# EAGLE design ESP32Weatherstation (EAGLE 9.5.2)
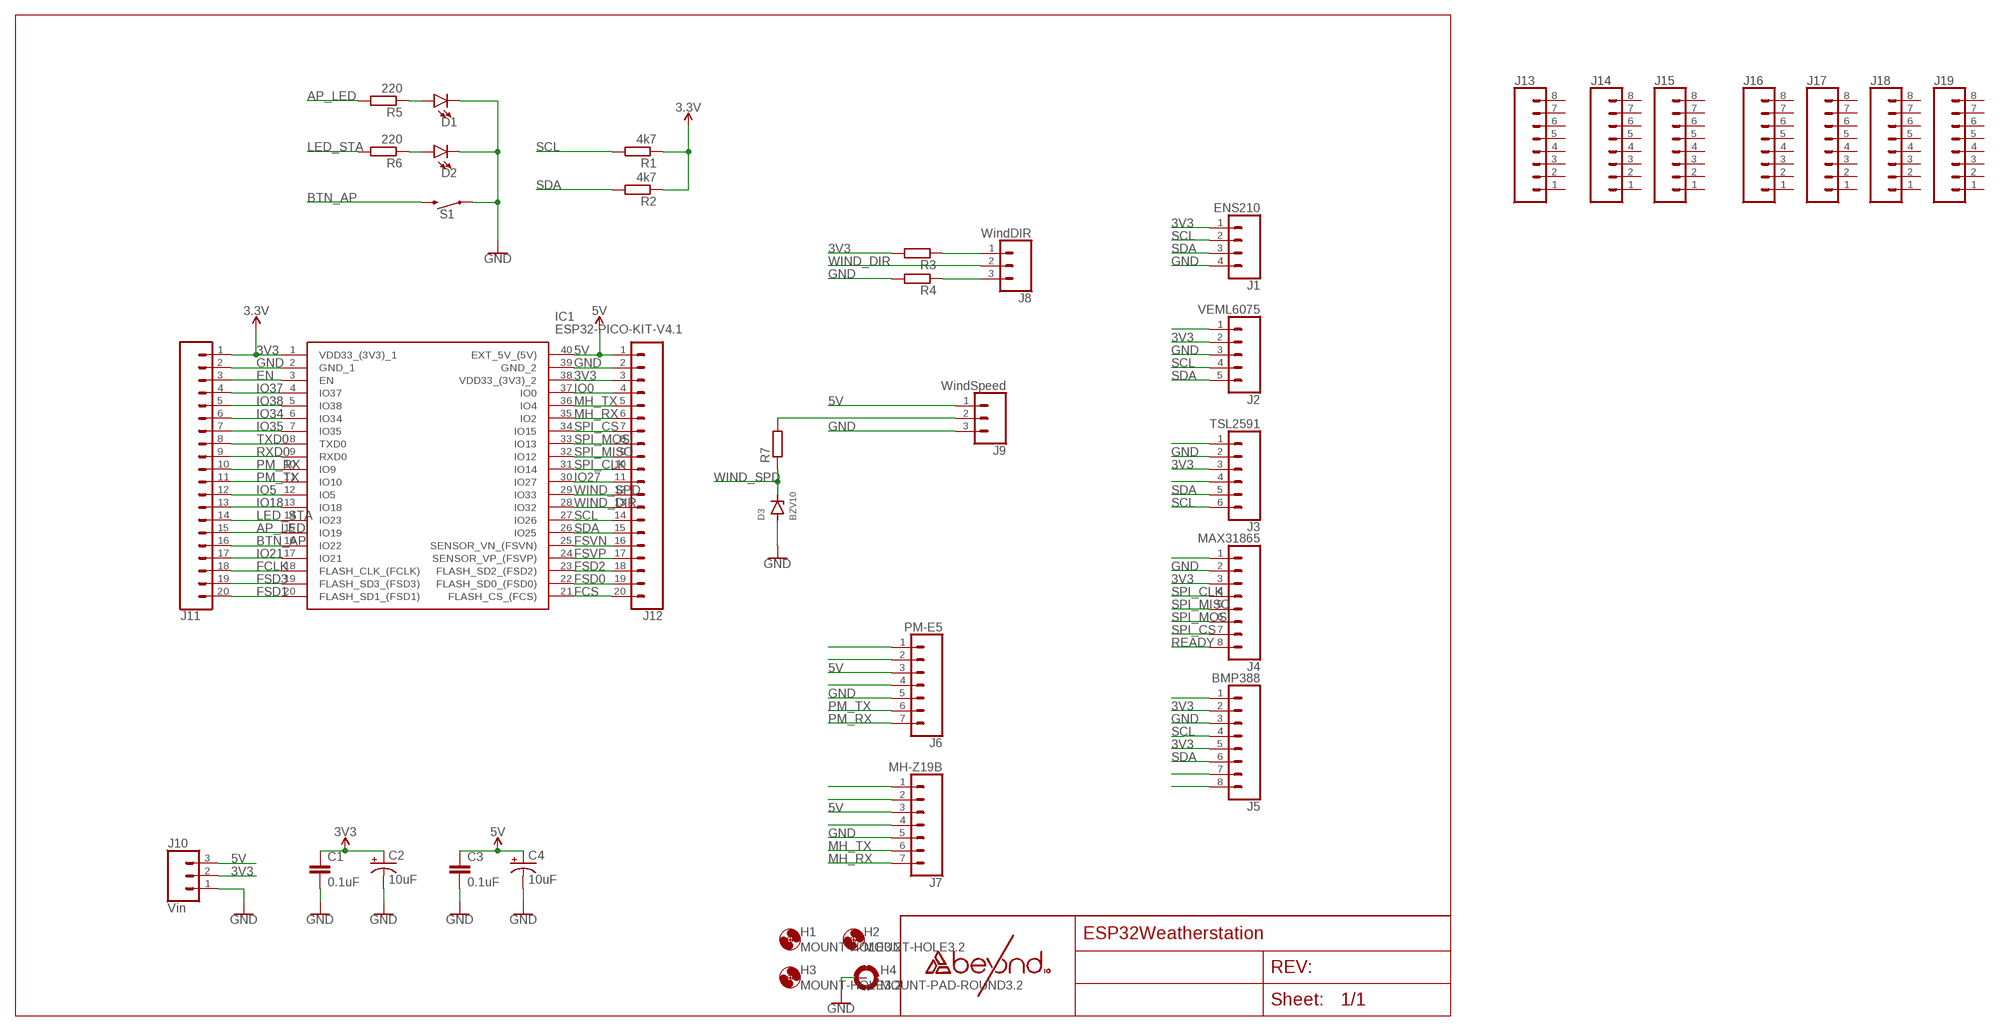
[diagram p0: schematic, sheet 1]

## Parts
C1  0.1uF  0.1UF-0603-25V-5%  [0603]
C2  10uF  10UF-POLAR-EIA3216-16V-10%(TANT)  [EIA3216]
C3  0.1uF  0.1UF-0603-25V-5%  [0603]
C4  10uF  10UF-POLAR-EIA3216-16V-10%(TANT)  [EIA3216]
D1  LED3MM  [LED_3MM]
D2  LED3MM  [LED_3MM]
D3  BZV10  [DO34Z7]
H1  MOUNT-HOLE3.2  [3,2]
H2  MOUNT-HOLE3.2  [3,2]
H3  MOUNT-HOLE3.2  [3,2]
H4  MOUNT-PAD-ROUND3.2  [3,2-PAD]
IC1  ESP32-PICO-KIT-V4.1  [DIPS1778W60P254L5200H1300Q40N]
J1  ENS210  CONN_041X04_NO_SILK  [1X04_NO_SILK]
J2  VEML6075  CONN_05NO_SILK  [1X05_NO_SILK]
J3  TSL2591  CONN_06NO_SILK_FEMALE_PTH  [1X06_NO_SILK]
J4  MAX31865  CONN_08NO_SILK_FEMALE_PTH  [1X08_NO_SILK]
J5  BMP388  CONN_08NO_SILK_FEMALE_PTH  [1X08_NO_SILK]
J6  PM-E5  CONN_07NO_SILK  [1X07_NO_SILK]
J7  MH-Z19B  CONN_07NO_SILK  [1X07_NO_SILK]
J8  WindDIR  CONN_031X03_NO_SILK  [1X03_NO_SILK]
J9  WindSpeed  CONN_031X03_NO_SILK  [1X03_NO_SILK]
J10  Vin  CONN_031X03_NO_SILK  [1X03_NO_SILK]
J11  CONN_20NOSILK  [1X20_NOSILK]
J12  CONN_20NOSILK  [1X20_NOSILK]
J13  CONN_08NO_SILK_FEMALE_PTH  [1X08_NO_SILK]
J14  CONN_08NO_SILK_FEMALE_PTH  [1X08_NO_SILK]
J15  CONN_08NO_SILK_FEMALE_PTH  [1X08_NO_SILK]
J16  CONN_08NO_SILK_FEMALE_PTH  [1X08_NO_SILK]
J17  CONN_08NO_SILK_FEMALE_PTH  [1X08_NO_SILK]
J18  CONN_08NO_SILK_FEMALE_PTH  [1X08_NO_SILK]
J19  CONN_08NO_SILK_FEMALE_PTH  [1X08_NO_SILK]
R1  4k7  R-EU_0207/10  [0207/10]
R2  4k7  R-EU_0207/10  [0207/10]
R3  R-EU_0207/10  [0207/10]
R4  R-EU_0207/10  [0207/10]
R5  220  R-EU_0207/10  [0207/10]
R6  220  R-EU_0207/10  [0207/10]
R7  R-EU_0207/10  [0207/10]
S1  MOMENTARY-SWITCH-SPST-SMD-5.2MM  [TACTILE_SWITCH_SMD_5.2MM]

## Nets
3V3: C1.1 C2.+ IC1.1(VDD33_(3V3)_1) IC1.38(VDD33_(3V3)_2) J1.1 J2.2 J3.3 J4.3 J5.2 J5.5 J10.2 J11.1 J12.3 R1.1 R2.1 R3.2 ; supply symbol labelled 3.3V
5V: C3.1 C4.+ IC1.40(EXT_5V_(5V)) J6.3 J7.3 J9.1 J10.3 J12.1
AP_LED: IC1.15(IO19) J11.15 R5.2
BTN_AP: IC1.16(IO22) J11.16 S1.3
EN: IC1.3(EN) J11.3
FCLK: IC1.18(FLASH_CLK_(FCLK)) J11.18
FCS: IC1.21(FLASH_CS_(FCS)) J12.20
FSD0: IC1.22(FLASH_SD0_(FSD0)) J12.19
FSD1: IC1.20(FLASH_SD1_(FSD1)) J11.20
FSD2: IC1.23(FLASH_SD2_(FSD2)) J12.18
FSD3: IC1.19(FLASH_SD3_(FSD3)) J11.19
FSVN: IC1.25(SENSOR_VN_(FSVN)) J12.16
FSVP: IC1.24(SENSOR_VP_(FSVP)) J12.17
GND: C1.2 C2.- C3.2 C4.- D1.K(C) D2.K(C) D3.A H4.B3,2(MOUNT) IC1.2(GND_1) IC1.39(GND_2) J1.4 J2.3 J3.2 J4.2 J5.3 J6.5 J7.5 J9.3 J10.1 J11.2 J12.2 R4.2 S1.1
IO0: IC1.37(IO0) J12.4
IO5: IC1.12(IO5) J11.12
IO18: IC1.13(IO18) J11.13
IO21: IC1.17(IO21) J11.17
IO27: IC1.30(IO27) J12.11
IO34: IC1.6(IO34) J11.6
IO35: IC1.7(IO35) J11.7
IO37: IC1.4(IO37) J11.4
IO38: IC1.5(IO38) J11.5
LED_STA: IC1.14(IO23) J11.14 R6.2
MH_RX: IC1.35(IO2) J7.7 J12.6
MH_TX: IC1.36(IO4) J7.6 J12.5
N$1: J8.1 R3.1
N$2: D1.A R5.1
N$3: D2.A R6.1
N$4: J8.3 R4.1
N$5: J9.2 R7.2
N$6: J6.1
N$7: J2.1
N$8: J6.2
N$10: J6.4
N$12: J3.1
N$15: J3.4
N$16: J7.1
N$18: J4.1
N$19: J7.2
N$20: J7.4
N$26: J5.1
N$32: J5.7
N$33: J5.8
PM_RX: IC1.10(IO9) J6.7 J11.10
PM_TX: IC1.11(IO10) J6.6 J11.11
READY: J4.8
RXD0: IC1.9(RXD0) J11.9
SCL: IC1.27(IO26) J1.2 J2.4 J3.6 J5.4 J12.14 R1.2
SDA: IC1.26(IO25) J1.3 J2.5 J3.5 J5.6 J12.15 R2.2
SPI_CLK: IC1.31(IO14) J4.4 J12.10
SPI_CS: IC1.34(IO15) J4.7 J12.7
SPI_MISO: IC1.32(IO12) J4.5 J12.9
SPI_MOSI: IC1.33(IO13) J4.6 J12.8
TXD0: IC1.8(TXD0) J11.8
WIND_DIR: IC1.28(IO32) J8.2 J12.13
WIND_SPD: D3.C IC1.29(IO33) J12.12 R7.1
Unconnected: J13.1 J13.2 J13.3 J13.4 J13.5 J13.6 J13.7 J13.8 J14.1 J14.2 J14.3 J14.4 J14.5 J14.6 J14.7 J14.8 J15.1 J15.2 J15.3 J15.4 J15.5 J15.6 J15.7 J15.8 J16.1 J16.2 J16.3 J16.4 J16.5 J16.6 J16.7 J16.8 J17.1 J17.2 J17.3 J17.4 J17.5 J17.6 J17.7 J17.8 J18.1 J18.2 J18.3 J18.4 J18.5 J18.6 J18.7 J18.8 J19.1 J19.2 J19.3 J19.4 J19.5 J19.6 J19.7 J19.8

## Library data of the parts
C1 C3 = SparkFun-Capacitors:0.1UF: 0.1µF ceramic capacitors A capacitor is a passive two-terminal electrical component used to store electrical energy temporarily in an electric field.; PROD_ID: CAP-08604
C2 C4 = SparkFun-Capacitors:10UF-POLAR: 10.0µF polarized capacitors A capacitor is a passive two-terminal electrical component used to store electrical energy temporarily in an electric field.; PROD_ID: CAP-00811
D1 D2 = SparkFun-LED:LED: LED (Generic) Standard schematic elements and footprints for 5mm, 3mm, 1206, and 0603 sized LEDs. Generic LEDs with no color specified.; PROD_ID: DIO-08794
D3 = diode:BZV10: Z DIODE
H1-H3 = holes:MOUNT-HOLE: MOUNTING HOLE with drill center marker
H4 = holes:MOUNT-PAD-ROUND: MOUNTING PAD, round
IC1 = ESP32-PICO-KIT-V4.1:ESP32-PICO-KIT-V4.1: WiFi Development Tools (802.11) Source: Datasheet <https://componentsearchengine.com/Datasheets/1/ESP32-PICO-KIT-V4.1.pdf>; DESCRIPTION: WiFi Development Tools (802.11); HEIGHT: 13mm; MANUFACTURER_NAME: Espressif Systems; MANUFACTURER_PART_NUMBER: ESP32-PICO-KIT-V4.1
J1 = SparkFun-Connectors:CONN_04: Multi connection point. Often used as Generic Header-pin footprint for 0.1 inch spaced/style header connections On any of the 0.1 inch spaced packages, you can populate with these: Break Away Headers - Straight <https://www.sparkfun.com/products/116> (PRT-00116) Break Away Male Headers - Right Angle <https://www.sparkfun.com/products/553> (PRT-00553) Female Headers <https://www.sparkfun.com/products/115> (PRT-00115) Break Away Headers - Machine Pin <https://www.sparkfun.com/products/117> (PRT-00117) Break Away Female Headers - Swiss Machine Pin <https://www.sparkfun.com/products/743> (PRT-00743) For SCREWTERMINALS and SPRING TERMINALS visit here: Screw Terimnals on SparkFun.com <https://www.sparkfun.com/search/results?term=Screw+Terminals> (5mm/3.5mm/2.54mm spacing) This device is also useful as a general connection point to wire up your design to another part of your project. Our various solder wires solder well into these plated through hole pads. Hook-Up Wire - Assortment (Stranded, 22 AWG) <https://www.sparkfun.com/products/11375> (PRT-11375) Hook-Up Wire - Assortment (Solid Core, 22 AWG) <https://www.sparkfun.com/products/11367> (PRT-11367) View the entire wire category on our website here <https://www.sparkfun.com/categories/141> Special notes: Molex polarized connector foot print use with SKU : PRT-08231 with associated crimp pins and housings. 1MM SMD Version SKU: PRT-10208; PROD_ID: CONN-09696
J2 = SparkFun-Connectors:CONN_05: Multi connection point. Often used as Generic Header-pin footprint for 0.1 inch spaced/style header connections On any of the 0.1 inch spaced packages, you can populate with these: Break Away Headers - Straight <https://www.sparkfun.com/products/116> (PRT-00116) Break Away Male Headers - Right Angle <https://www.sparkfun.com/products/553> (PRT-00553) Female Headers <https://www.sparkfun.com/products/115> (PRT-00115) Break Away Headers - Machine Pin <https://www.sparkfun.com/products/117> (PRT-00117) Break Away Female Headers - Swiss Machine Pin <https://www.sparkfun.com/products/743> (PRT-00743) For SCREWTERMINALS and SPRING TERMINALS visit here: Screw Terimnals on SparkFun.com <https://www.sparkfun.com/search/results?term=Screw+Terminals> (5mm/3.5mm/2.54mm spacing) This device is also useful as a general connection point to wire up your design to another part of your project. Our various solder wires solder well into these plated through hole pads. Hook-Up Wire - Assortment (Stranded, 22 AWG) <https://www.sparkfun.com/products/11375> (PRT-11375) Hook-Up Wire - Assortment (Solid Core, 22 AWG) <https://www.sparkfun.com/products/11367> (PRT-11367) View the entire wire category on our website here <https://www.sparkfun.com/categories/141> Special notes: Molex polarized connector foot print use with SKU : PRT-08231 with associated crimp pins and housings. 1MM SMD Version SKU: PRT-10208
J3 = SparkFun-Connectors:CONN_06: Multi connection point. Often used as Generic Header-pin footprint for 0.1 inch spaced/style header connections On any of the 0.1 inch spaced packages, you can populate with these: Break Away Headers - Straight <https://www.sparkfun.com/products/116> (PRT-00116) Break Away Male Headers - Right Angle <https://www.sparkfun.com/products/553> (PRT-00553) Female Headers <https://www.sparkfun.com/products/115> (PRT-00115) Break Away Headers - Machine Pin <https://www.sparkfun.com/products/117> (PRT-00117) Break Away Female Headers - Swiss Machine Pin <https://www.sparkfun.com/products/743> (PRT-00743) Arduino Stackable Header - 6 Pin <https://www.sparkfun.com/products/9280> (PRT-09280) For SCREWTERMINALS and SPRING TERMINALS visit here: Screw Terimnals on SparkFun.com <https://www.sparkfun.com/search/results?term=Screw+Terminals> (5mm/3.5mm/2.54mm spacing) This device is also useful as a general connection point to wire up your design to another part of your project. Our various solder wires solder well into these plated through hole pads. Hook-Up Wire - Assortment (Stranded, 22 AWG) <https://www.sparkfun.com/products/11375> (PRT-11375) Hook-Up Wire - Assortment (Solid Core, 22 AWG) <https://www.sparkfun.com/products/11367> (PRT-11367) View the entire wire category on our website here <https://www.sparkfun.com/categories/141>; PROD_ID: CONN-08437
J4 J5 J13-J19 = SparkFun-Connectors:CONN_08: Multi connection point. Often used as Generic Header-pin footprint for 0.1 inch spaced/style header connections On any of the 0.1 inch spaced packages, you can populate with these: Break Away Headers - Straight <https://www.sparkfun.com/products/116> (PRT-00116) Break Away Male Headers - Right Angle <https://www.sparkfun.com/products/553> (PRT-00553) Female Headers <https://www.sparkfun.com/products/115> (PRT-00115) Break Away Headers - Machine Pin <https://www.sparkfun.com/products/117> (PRT-00117) Break Away Female Headers - Swiss Machine Pin <https://www.sparkfun.com/products/743> (PRT-00743) Arduino Stackable Header - 8 Pin <https://www.sparkfun.com/products/9279> (PRT-09279) For SCREWTERMINALS and SPRING TERMINALS visit here: Screw Terimnals on SparkFun.com <https://www.sparkfun.com/search/results?term=Screw+Terminals> (5mm/3.5mm/2.54mm spacing) This device is also useful as a general connection point to wire up your design to another part of your project. Our various solder wires solder well into these plated through hole pads. Hook-Up Wire - Assortment (Stranded, 22 AWG) <https://www.sparkfun.com/products/11375> (PRT-11375) Hook-Up Wire - Assortment (Solid Core, 22 AWG) <https://www.sparkfun.com/products/11367> (PRT-11367) View the entire wire category on our website here <https://www.sparkfun.com/categories/141> Special notes: Molex polarized connector foot print use with SKU : PRT-08231 with associated crimp pins and housings. 1MM SMD Version SKU: PRT-10208 NOTES ON THE VARIANTS LOCK and LOCK_LONGPADS... This footprint was designed to help hold the alignment of a through-hole component (i.e. 6-pin header) while soldering it into place. You may notice that each hole has been shifted either up or down by 0.005 of an inch from it's more standard position (which is a perfectly straight line). This slight alteration caused the pins (the squares in the middle) to touch the edges of the holes. Because they are alternating, it causes a "brace" to hold the component in place. 0.005 has proven to be the perfect amount of "off-center" position when using our standard breakaway headers. Although looks a little odd when you look at the bare footprint, once you have a header in there, the alteration is very hard to notice. Also,if you push a header all the way into place, it is covered up entirely on the bottom side.; PROD_ID: CONN-08438
J6 J7 = SparkFun-Connectors:CONN_07: Multi connection point. Often used as Generic Header-pin footprint for 0.1 inch spaced/style header connections On any of the 0.1 inch spaced packages, you can populate with these: Break Away Headers - Straight <https://www.sparkfun.com/products/116> (PRT-00116) Break Away Male Headers - Right Angle <https://www.sparkfun.com/products/553> (PRT-00553) Female Headers <https://www.sparkfun.com/products/115> (PRT-00115) Break Away Headers - Machine Pin <https://www.sparkfun.com/products/117> (PRT-00117) Break Away Female Headers - Swiss Machine Pin <https://www.sparkfun.com/products/743> (PRT-00743) For SCREWTERMINALS and SPRING TERMINALS visit here: Screw Terimnals on SparkFun.com <https://www.sparkfun.com/search/results?term=Screw+Terminals> (5mm/3.5mm/2.54mm spacing) This device is also useful as a general connection point to wire up your design to another part of your project. Our various solder wires solder well into these plated through hole pads. Hook-Up Wire - Assortment (Stranded, 22 AWG) <https://www.sparkfun.com/products/11375> (PRT-11375) Hook-Up Wire - Assortment (Solid Core, 22 AWG) <https://www.sparkfun.com/products/11367> (PRT-11367) View the entire wire category on our website here <https://www.sparkfun.com/categories/141> Special notes: Molex polarized connector foot print use with SKU : PRT-08231 with associated crimp pins and housings. 1MM SMD Version SKU: PRT-10208 NOTES ON THE VARIANTS LOCK and LOCK_LONGPADS... This footprint was designed to help hold the alignment of a through-hole component (i.e. 6-pin header) while soldering it into place. You may notice that each hole has been shifted either up or down by 0.005 of an inch from it's more standard position (which is a perfectly straight line). This slight alteration caused the pins (the squares in the middle) to touch the edges of the holes. Because they are alternating, it causes a "brace" to hold the component in place. 0.005 has proven to be the perfect amount of "off-center" position when using our standard breakaway headers. Although looks a little odd when you look at the bare footprint, once you have a header in there, the alteration is very hard to notice. Also,if you push a header all the way into place, it is covered up entirely on the bottom side.
J8-J10 = SparkFun-Connectors:CONN_03: Multi connection point. Often used as Generic Header-pin footprint for 0.1 inch spaced/style header connections On any of the 0.1 inch spaced packages, you can populate with these: Break Away Headers - Straight <https://www.sparkfun.com/products/116> (PRT-00116) Break Away Male Headers - Right Angle <https://www.sparkfun.com/products/553> (PRT-00553) Female Headers <https://www.sparkfun.com/products/115> (PRT-00115) Break Away Headers - Machine Pin <https://www.sparkfun.com/products/117> (PRT-00117) Break Away Female Headers - Swiss Machine Pin <https://www.sparkfun.com/products/743> (PRT-00743) Stackable Header - 3 Pin (Female, 0.1") <https://www.sparkfun.com/products/13875> (PRT-13875) For SCREWTERMINALS and SPRING TERMINALS visit here: Screw Terimnals on SparkFun.com <https://www.sparkfun.com/search/results?term=Screw+Terminals> (5mm/3.5mm/2.54mm spacing) This device is also useful as a general connection point to wire up your design to another part of your project. Our various solder wires solder well into these plated through hole pads. Hook-Up Wire - Assortment (Stranded, 22 AWG) <https://www.sparkfun.com/products/11375> (PRT-11375) Hook-Up Wire - Assortment (Solid Core, 22 AWG) <https://www.sparkfun.com/products/11367> (PRT-11367) View the entire wire category on our website here <https://www.sparkfun.com/categories/141> Special notes: Molex polarized connector foot print use with SKU : PRT-08232 with associated crimp pins and housings.
J11 J12 = SparkFun-Connectors:CONN_20: Multi connection point. Often used as Generic Header-pin footprint for 0.1 inch spaced/style header connections On any of the 0.1 inch spaced packages, you can populate with these: Break Away Headers - Straight <https://www.sparkfun.com/products/116> (PRT-00116) Break Away Male Headers - Right Angle <https://www.sparkfun.com/products/553> (PRT-00553) Female Headers <https://www.sparkfun.com/products/115> (PRT-00115) Break Away Headers - Machine Pin <https://www.sparkfun.com/products/117> (PRT-00117) Break Away Female Headers - Swiss Machine Pin <https://www.sparkfun.com/products/743> (PRT-00743) For SCREWTERMINALS and SPRING TERMINALS visit here: Screw Terimnals on SparkFun.com <https://www.sparkfun.com/search/results?term=Screw+Terminals> (5mm/3.5mm/2.54mm spacing) This device is also useful as a general connection point to wire up your design to another part of your project. Our various solder wires solder well into these plated through hole pads. Hook-Up Wire - Assortment (Stranded, 22 AWG) <https://www.sparkfun.com/products/11375> (PRT-11375) Hook-Up Wire - Assortment (Solid Core, 22 AWG) <https://www.sparkfun.com/products/11367> (PRT-11367) View the entire wire category on our website here <https://www.sparkfun.com/categories/141> Special notes: Molex polarized connector foot print use with SKU : PRT-08231 with associated crimp pins and housings. 1MM SMD Version SKU: PRT-10208 NOTES ON THE VARIANTS LOCK and LOCK_LONGPADS... This footprint was designed to help hold the alignment of a through-hole component (i.e. 6-pin header) while soldering it into place. You may notice that each hole has been shifted either up or down by 0.005 of an inch from it's more standard position (which is a perfectly straight line). This slight alteration caused the pins (the squares in the middle) to touch the edges of the holes. Because they are alternating, it causes a "brace" to hold the component in place. 0.005 has proven to be the perfect amount of "off-center" position when using our standard breakaway headers. Although looks a little odd when you look at the bare footprint, once you have a header in there, the alteration is very hard to notice. Also,if you push a header all the way into place, it is covered up entirely on the bottom side. Note about LOCK SPECIAL package: This is just like the LOCK variant in that the holes are staggared by 5 mil, but except for the last two holes. They are not altered from the "standard" footprint layout. This is used for a special purpose on the layout of our Graphic LCD Backpack. Make sure you want to use this device before selecting it for you project!
R1-R7 = resistor:R-EU_: RESISTOR, European symbol
S1 = SparkFun-Switches:MOMENTARY-SWITCH-SPST: Momentary Switch (Pushbutton) - SPST Normally-open (NO) SPST momentary switches (buttons, pushbuttons). Variants PTH-12MM - 12mm square, through-hole Momentary Pushbutton Switch - 12mm Square <https://www.sparkfun.com/products/9190> (COM-09190) PTH-6.0MM, PTH-6.0MM-KIT - 6.0mm square, through-hole Mini Pushbutton Switch <https://www.sparkfun.com/products/97> (COM-00097) KIT package intended for soldering kit's - only one side of pads' copper is exposed. PTH-RIGHT-ANGLE-KIT - Right-angle, through-hole Right Angle Tactile Button <https://www.sparkfun.com/products/10791> - Used on SparkFun BigTime Watch Kit <https://www.sparkfun.com/products/11734> SMD-12MM - 12mm square, surface-mount Tactile Button - SMD (12mm) <https://www.sparkfun.com/products/12993> (COM-12993) Used on SparkFun PicoBoard <https://www.sparkfun.com/products/11888> SMD-4.5MM - 4.5mm Square Trackball Switch Used on SparkFun Blackberry Trackballer Breakout <https://www.sparkfun.com/products/13169> SMD-4.6MMX2.8MM - 4.60mm x 2.80mm, surface mount Used on SparkFun SAMD21 Mini Breakout <https://www.sparkfun.com/products/13664> SMD-5.2MM, SMD-5.2-REDUNDANT - 5.2mm square, surface-mount Mini Pushbutton Switch - SMD <https://www.sparkfun.com/products/8720> (COM-08720) Used on Arduino Pro Mini <https://www.sparkfun.com/products/11114> REDUNDANT package connects both switch circuits together SMD-6.0X3.5MM - 6.0 x 3.5mm, surface mount Momentary Reset Switch SMD <https://www.sparkfun.com/products/8229> (COM-08229) SMD-6.2MM-TALL - 6.2mm square, surface mount Tactile Button - SMD (6mm) <https://www.sparkfun.com/products/12992> Used on SparkFun Digital Sandbox <https://www.sparkfun.com/products/12651> SMD-RIGHT-ANGLE - Right-angle, surface mount Used on SparkFun Block for Intel® Edison - Arduino <https://www.sparkfun.com/products/13036>; PROD_ID: SWCH-08247; SF_SKU: COM-08720

## Board
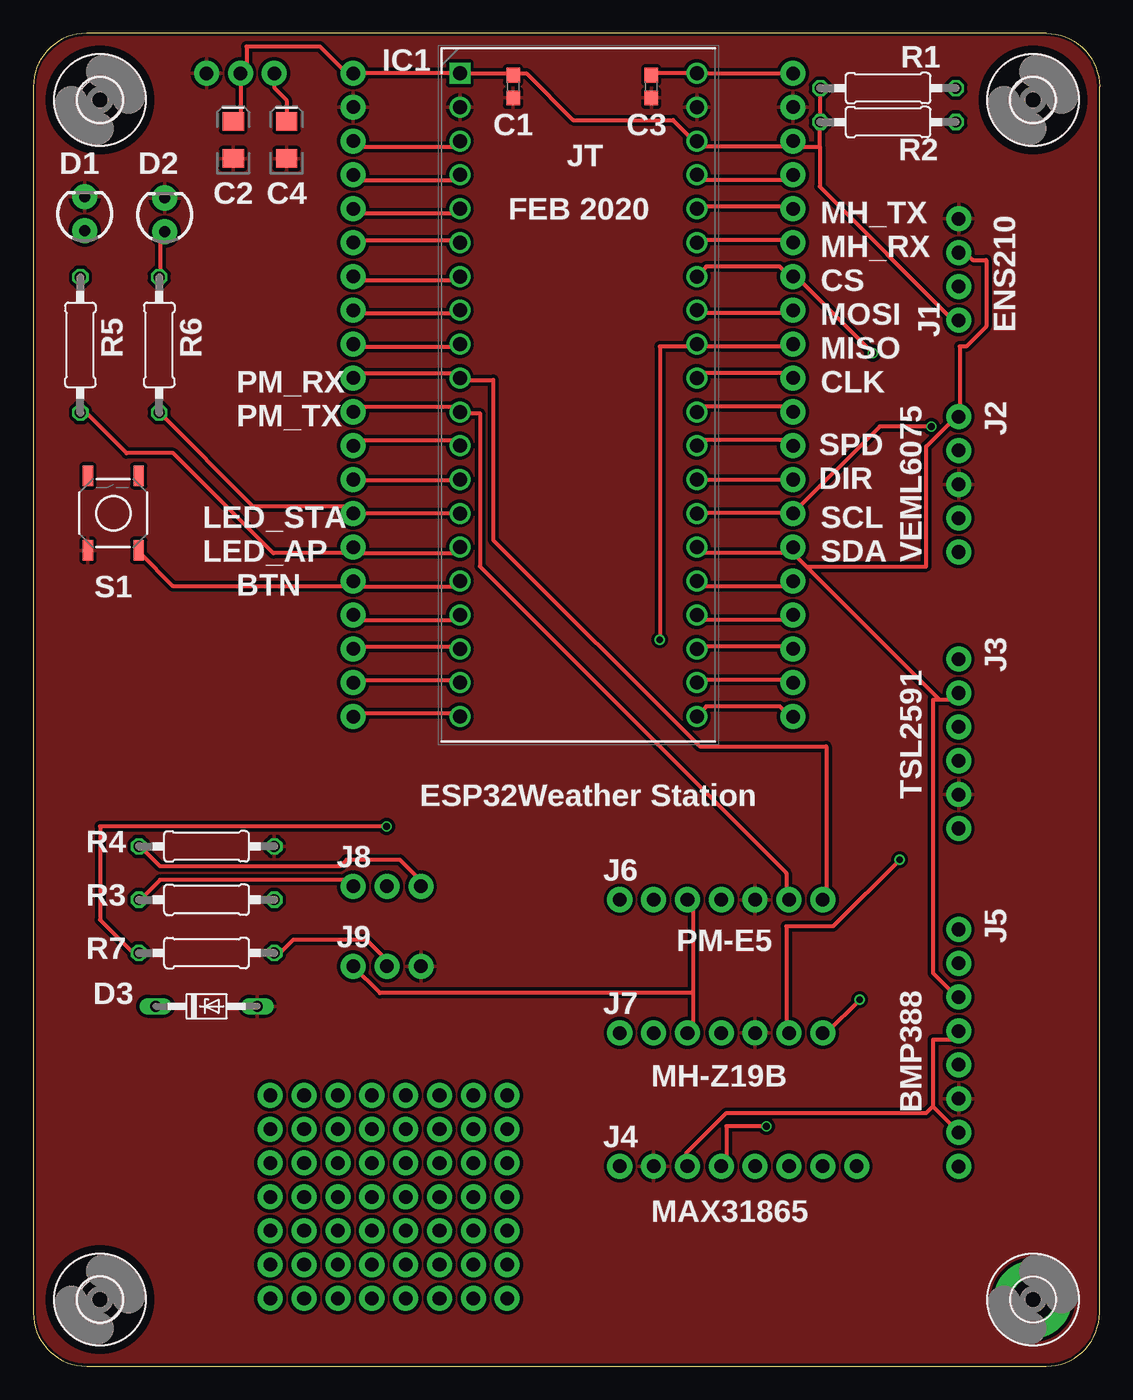
[diagram p1: board, top side]
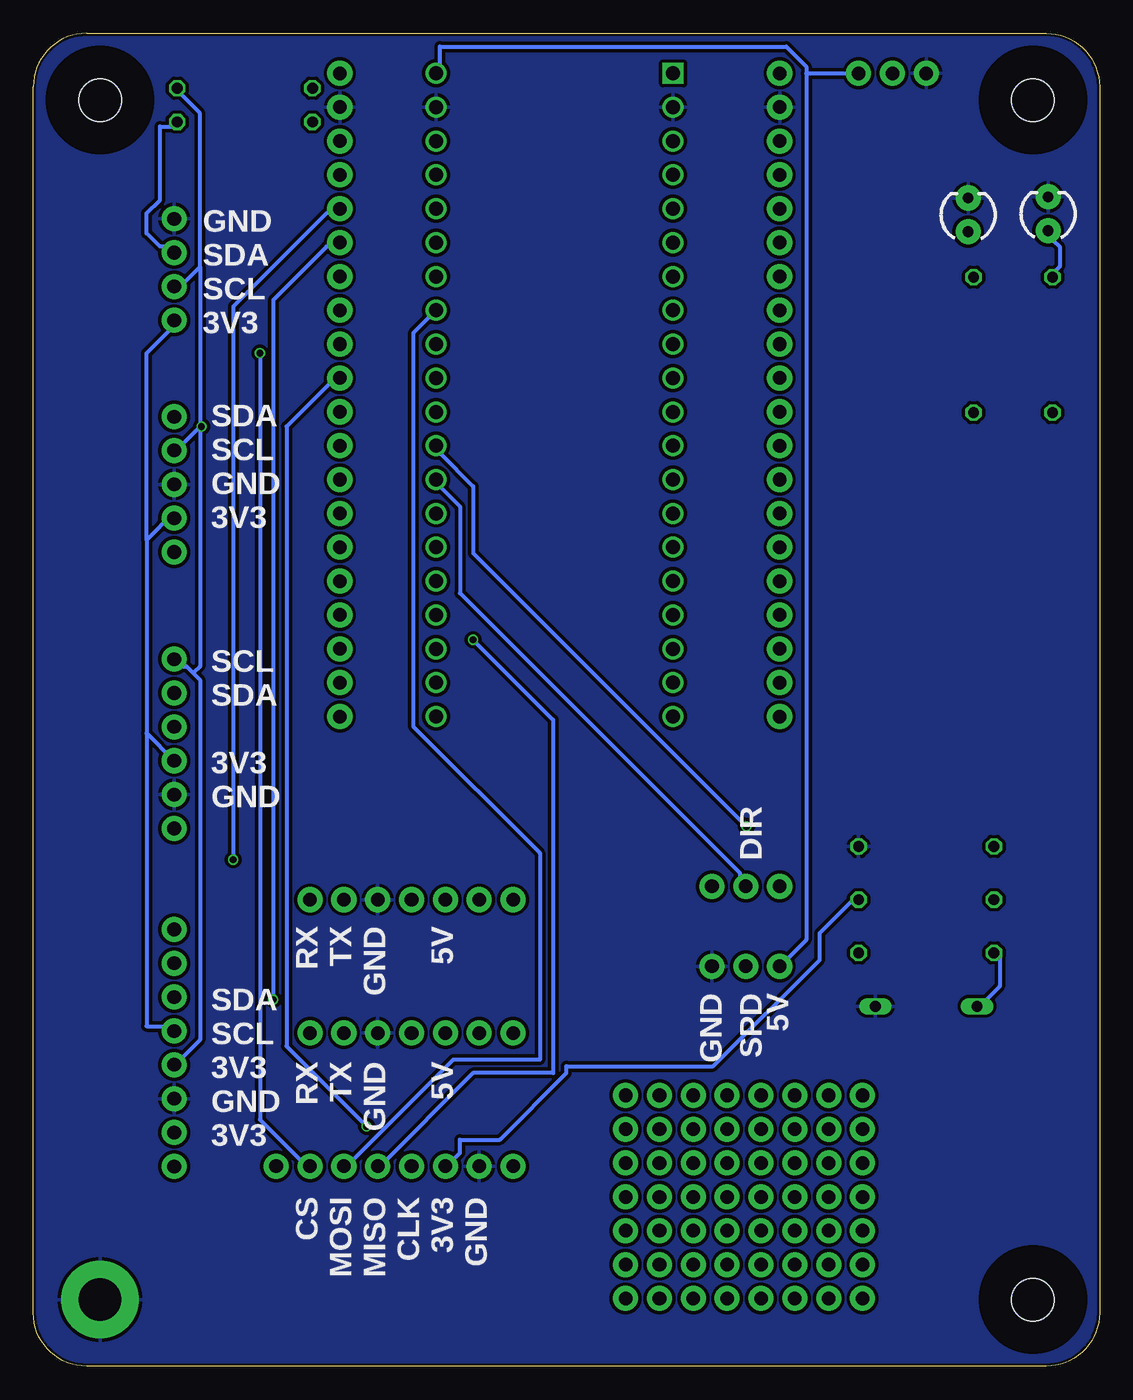
[diagram p2: board, bottom side, seen from below]

Size 80 x 100 mm. Coordinates in mm from the lower left corner, seen from the top.
Outline: 4,0 76,0 arc90 80,4 80,96 arc90 76,100 4,100 arc90 0,96 0,4 arc90 4,0
Copper layers (1*16): Top 0.035559375mm / dielectric 1.6mm / Bottom 0.035559375mm
Design rules "jlcpcb2layer *": minimum track width 12mil, minimum drill 20mil, track to track 10mil, track to pad 10mil, pad to pad 10mil, via to via 10mil, smd to smd 10mil, copper to edge 8mil, drill to drill 6mil, minimum pad ring 5mil, minimum via ring 3mil, stop-mask expansion 2.5mil, vias tented up to drill 0mil, thermal gap 10mil

### Footprints (pad centres in the part's own frame; a part is rotated, then mirrored left to right if it is on the bottom)
0603 = smd 1.1 x 1: 1 -0.85,0; 2 0.85,0
EIA3216 = smd 1.4 x 1.6: + 1.4,0; - -1.4,0
LED_3MM = drill 0.813 pad 1.88: A -1.27,0; K 1.27,0
DO34Z7 = drill 0.813 long: A 3.81,0; C -3.81,0
3,2 = hole 3.2: 0,0
3,2-PAD = drill 3.2 pad 5.842: B3,2 0,0
DIPS1778W60P254L5200H1300Q40N = drill 1.05 pad 1.575 square: 1 0,0 | drill 1.05 pad 1.575: 2 0,-2.54; 3 0,-5.08; 4 0,-7.62; 5 0,-10.16; 6 0,-12.7; 7 0,-15.24; 8 0,-17.78; 9 0,-20.32; 10 0,-22.86; 11 0,-25.4; 12 0,-27.94; 13 0,-30.48; 14 0,-33.02; 15 0,-35.56; 16 0,-38.1; 17 0,-40.64; 18 0,-43.18; 19 0,-45.72; 20 0,-48.26; 21 17.78,-48.26; 22 17.78,-45.72; 23 17.78,-43.18; 24 17.78,-40.64; 25 17.78,-38.1; 26 17.78,-35.56; 27 17.78,-33.02; 28 17.78,-30.48; 29 17.78,-27.94; 30 17.78,-25.4; 31 17.78,-22.86; 32 17.78,-20.32; 33 17.78,-17.78; 34 17.78,-15.24; 35 17.78,-12.7; 36 17.78,-10.16; 37 17.78,-7.62; 38 17.78,-5.08; 39 17.78,-2.54; 40 17.78,0
1X04_NO_SILK = drill 1.016 pad 1.88: 1 0,0; 2 2.54,0; 3 5.08,0; 4 7.62,0
1X05_NO_SILK = drill 1.016 pad 1.88: 1 0,0; 2 2.54,0; 3 5.08,0; 4 7.62,0; 5 10.16,0
1X06_NO_SILK = drill 1.016 pad 1.88: 1 0,0; 2 2.54,0; 3 5.08,0; 4 7.62,0; 5 10.16,0; 6 12.7,0
1X08_NO_SILK = drill 1.016 pad 1.88: 1 0,0; 2 2.54,0; 3 5.08,0; 4 7.62,0; 5 10.16,0; 6 12.7,0; 7 15.24,0; 8 17.78,0
1X07_NO_SILK = drill 1.016 pad 1.88: 1 0,0; 2 2.54,0; 3 5.08,0; 4 7.62,0; 5 10.16,0; 6 12.7,0; 7 15.24,0
1X03_NO_SILK = drill 1.016 pad 1.88: 1 0,0; 2 2.54,0; 3 5.08,0
1X20_NOSILK = drill 1.016 pad 1.88: 1 0,0; 2 2.54,0; 3 5.08,0; 4 7.62,0; 5 10.16,0; 6 12.7,0; 7 15.24,0; 8 17.78,0; 9 20.32,0; 10 22.86,0; 11 25.4,0; 12 27.94,0; 13 30.48,0; 14 33.02,0; 15 35.56,0; 16 38.1,0; 17 40.64,0; 18 43.18,0; 19 45.72,0; 20 48.26,0
0207/10 = drill 0.813 octagon: 1 -5.08,0; 2 5.08,0
TACTILE_SWITCH_SMD_5.2MM = smd 1.524 x 0.762: 1 -2.794,1.905; 2 2.794,1.905; 3 -2.794,-1.905; 4 2.794,-1.905

### Placement (x,y rotation side)
C1  36,96 270 top
C2  15,92 90 top
C3  46.37,96 270 top
C4  19,92 90 top
D1  3.86,86.46 90 top
D2  9.86,86.38 90 top
D3  13,27 0 top
H1  75,95 0 top
H2  5,95 0 top
H3  5,5 0 top
H4  75,5 0 top
IC1  32,97 0 top
J1  69.43,78.47 90 top
J2  69.43,61.08 90 top
J3  69.43,40.34 90 top
J4  44,15 0 top
J5  69.43,14.99 90 top
J6  44,35 0 top
J7  44,25 0 top
J8  24,36 0 top
J9  24,30 0 top
J10  13,97 0 top
J11  24,97 270 top
J12  57,97 270 top
J13  17.78,20.32 0 top
J14  17.78,17.78 0 top
J15  17.78,15.24 0 top
J16  17.78,12.7 0 top
J17  17.78,10.16 0 top
J18  17.78,7.62 0 top
J19  17.78,5.08 0 top
R1  64.14,95.89 0 top
R2  64.14,93.34 0 top
R3  13,35 0 top
R4  13,39 0 top
R5  3.53,76.62 270 top
R6  9.45,76.62 270 top
R7  13,31 0 top
S1  6,64 90 top

### Tracks (layer width: path | path; a pad name or v marks a point on that pad's centre or on a via)
3V3
  Top 0.305: 67.5,19.5 69,18 J5.2 | 67.5,19.5 67.5,24.5 69,24.5 69.5,25 J5.5 | 67.5,19.5 67,19 52,19 49,16 49,15 J4.3 | R1.1 59,95.5 59,93.5 R2.1 59,93 59,91.5 | 57,91.5 50,91.5 IC1.38 49.5,92 48,93.5 40.5,93.5 37,97 36,97 | 57,91.5 59,91.5 | 57,91.5 J12.3 | 36,97 IC1.1 J11.1 23.5,97 21.5,99 16,99 16,97 J10.2 15.54,93.94 C2.+ | 36,97 C1.1 | 59,91.5 59,88.5 69,78.5 J1.1
  Bottom 0.305: R3.2 18.5,35 21,32.5 21,30.5 29,22.5 40,22.5 40,22 45,17 48,17 48,16 49,15 J4.3 | 71.5,47.5 69.5,45.5 J3.3 | 71.5,62 71.5,47.5 | 71.5,62 69.5,64 J2.2 | 71.5,62 71.5,76 69.5,78 J1.1 | 71.5,47.5 71.5,25.5 69.5,25.5 J5.5
5V
  Top 0.305: 49.5,28 49.5,35 J6.3 | 49.5,28 49.5,25 J7.3 | J9.1 26,28 49.5,28 | C3.1 46.5,97 IC1.40 J12.1 | J10.3 18.08,95.92 19,95 C4.+
  Bottom 0.305: 22,97 J10.3 | 22,97 22,97.5 23.5,99 49.5,99 49.5,97 IC1.40 | J9.1 22,32 22,97
AP_LED
  Top 0.305: 24,61 18,61 10.5,68.5 7,68.5 4,71.5 R5.2 | 24,61 32,61 IC1.15 | 24,61 J11.15
BTN_AP
  Top 0.305: 24,58.5 10.5,58.5 8,61 S1.3 | 24,58.5 32,58.5 IC1.16 | 24,58.5 J11.16
EN
  Top 0.305: IC1.3 32,91.5 24,91.5 J11.3
FCLK
  Top 0.305: IC1.18 32,54 24,54 J11.18
FCS
  Top 0.305: IC1.21 50,49 50.5,49.5 56,49.5 56.5,49 57,49 J12.20
FSD0
  Top 0.305: IC1.22 50,51.5 57,51.5 J12.19
FSD1
  Top 0.305: IC1.20 32,49 24,49 J11.20
FSD2
  Top 0.305: IC1.23 50,54 57,54 J12.18
FSD3
  Top 0.305: IC1.19 32,51.5 24,51.5 J11.19
FSVN
  Top 0.305: IC1.25 50,58.5 57,58.5 J12.16
FSVP
  Top 0.305: IC1.24 50,56 57,56 J12.17
GND
  pour Top: 0,100 80,100 80,0 0,0
  pour Bottom: 0,100 80,100 80,0 0,0
IO0
  Top 0.305: IC1.37 50,89 57,89 J12.4
IO5
  Top 0.305: IC1.12 32,69.5 24,69.5 J11.12
IO18
  Top 0.305: IC1.13 32,66.5 24,66.5 J11.13
IO21
  Top 0.305: IC1.17 32,56 24,56 J11.17
IO27
  Top 0.305: IC1.30 50,72 57,72 J12.11
IO34
  Top 0.305: IC1.6 32,84.5 24,84.5 J11.6
IO35
  Top 0.305: IC1.7 32,81.5 24,81.5 J11.7
IO37
  Top 0.305: IC1.4 32,89 24,89 J11.4
IO38
  Top 0.305: IC1.5 32,86.5 24,86.5 J11.5
LED_STA
  Top 0.305: 24,64 23.5,64.5 16.5,64.5 9.5,71.5 R6.2 | 24,64 32,64 IC1.14 | 24,64 J11.14
MH_RX  (via drill 0.51)
  Top 0.305: IC1.35 50,84.5 57,84.5 J12.6 | v62,27.5 59.5,25 J7.7
  Bottom 0.305: v62,27.5 62,80 58,84 57,84 J12.6
MH_TX  (via drill 0.51)
  Top 0.305: IC1.36 50,87 57,87 J12.5 | v65,38 60,33 56.5,33 56.5,25 J7.6
  Bottom 0.305: v65,38 65,79.5 58,86.5 57,86.5 J12.5
N$1
  Top 0.305: J8.1 23.5,36.5 9.5,36.5 8,35 R3.1
N$2
  Bottom 0.305: R5.1 3.5,82 3,82.5 3,84 3.5,84.5 3.5,85 D1.A
N$3
  Top 0.305: R6.1 9.5,82 9.5,85 D2.A
N$4
  Top 0.305: R4.1 8,39 9.5,37.5 23,37.5 23.5,38 27.5,38 29.5,36 J8.3
N$5
  Top 0.305: R7.2 18.5,31 19.5,32 25,32 27,30 J9.2
PM_RX
  Top 0.305: J11.10 24,74.5 32,74.5 IC1.10 32,74 34.5,74 34.5,62 50,46.5 59.5,46.5 59.5,35 J6.7
PM_TX
  Top 0.305: J11.11 24,72 32,72 IC1.11 32,71.5 33.5,71.5 33.5,60 56.5,37 56.5,35 J6.6
RXD0
  Top 0.305: IC1.9 32,76.5 24,76.5 J11.9
SCL  (via drill 0.51)
  Top 0.305: 57,64 50,64 IC1.27 | 57,64 63.5,70.5 v67.38,70.5 | 57,64 J12.14
  Bottom 0.305: 68,52 68.5,52.5 69,52.5 69,53 J3.6 | 68,52 67.5,51.5 67.5,24.5 69,23 J5.4 | 67.5,82.5 67.5,94 69,95.5 R1.2 | 67.5,82.5 69,81 J1.2 | 67.5,70.5 69,69 J2.4 | 67.5,82.5 67.5,70.5 | 67.5,70.5 v67.38,70.5 | 68,52 67.5,52.5 67.5,70.5
SDA
  Top 0.305: J1.3 69.5,83.5 70,83.5 70.5,83 71.5,83 71.5,78 70,76.5 69.5,76.5 69.5,71.5 J2.5 69,71 67,69 67,60 58,60 | 57,61 50,61 IC1.26 | 68,50 69,50 69.5,50.5 J3.5 | 68,50 67.5,50 67.5,29.5 69,28 J5.6 | 68,50 58,60 | 58,60 57,61 | 57,61 J12.15
  Bottom 0.305: R2.2 69.5,93 70.5,93 70.5,87.5 71.5,86.5 71.5,85 70.5,84 69.5,84 J1.3
SPI_CLK  (via drill 0.51)
  Top 0.305: IC1.31 50,74.5 57,74.5 J12.10 | v55,18 52,18 52,15 J4.4
  Bottom 0.305: v55,18 61,24 61,70.5 57,74.5 J12.10
SPI_CS  (via drill 0.51)
  Top 0.305: IC1.34 50,82 50.5,82.5 56,82.5 56.5,82 57,82 J12.7 57,81.5 57.5,81.5 v63,76
  Bottom 0.305: v63,76 63,18.5 59.5,15 J4.7
SPI_MISO  (via drill 0.51)
  Top 0.305: J12.9 57,76.5 50,76.5 IC1.32 49.5,76.5 47,76.5 v47,54.5
  Bottom 0.305: v47,54.5 41,48.5 41,22 47,22 54,15 J4.5
SPI_MOSI
  Top 0.305: IC1.33 50,79 57,79 J12.8
  Bottom 0.305: IC1.33 51.5,77.5 51.5,48 42,38.5 42,23 48.5,23 56.5,15 J4.6
TXD0
  Top 0.305: IC1.8 32,79 24,79 J11.8
WIND_DIR
  Top 0.305: IC1.28 50,66.5 57,66.5 J12.13
  Bottom 0.305: J8.2 27,36 27,37 48,58 48,64.5 49.5,66 49.5,66.5 IC1.28
WIND_SPD  (via drill 0.51)
  Top 0.305: IC1.29 50,69.5 57,69.5 J12.12 | v26.5,40.5 5,40.5 5,33.5 7.5,31 R7.1
  Bottom 0.305: D3.C 9,27 7.5,28.5 7.5,31 R7.1 | v26.5,40.5 47,61 47,66 49.5,68.5 49.5,69 IC1.29

### Text on the board
tPlace: JT | FEB 2020 | MH_TX | ENS210 | MH_RX | CS | MOSI | MISO | PM_RX | CLK | PM_TX | SPD | DIR | LED_STA | SCL | LED_AP | SDA | VEML6075 | BTN | TSL2591 | ESP32Weather Station | PM-E5 | MH-Z19B | BMP388 | MAX31865
bPlace: GND | SDA | SCL | 3V3 | SDA | SCL | GND | 3V3 | SCL | SDA | 3V3 | DIR | GND | 5V | GND | TX | RX | 5V | SPD | GND | SDA | SCL | 5V | GND | TX | RX | 3V3 | GND | 3V3 | GND | 3V3 | CLK | MISO | MOSI | CS